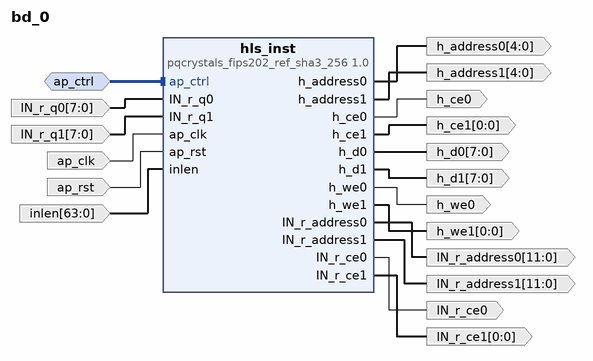
[diagram p0: block diagram of the top level]
# Vivado block design bd_0, xc7a75tlftg256-2L, Vivado 2018.3
create_bd_design bd_0

create_bd_intf_port -mode Slave -vlnv xilinx.com:interface:acc_handshake_rtl:1.0 ap_ctrl
create_bd_port -dir O -from 11 -to 0 -type data IN_r_address0
create_bd_port -dir O -from 11 -to 0 -type data IN_r_address1
create_bd_port -dir O IN_r_ce0
create_bd_port -dir O -from 0 -to 0 -type data IN_r_ce1
create_bd_port -dir I -from 7 -to 0 -type data IN_r_q0
set_property -dict [list \
  CONFIG.LAYERED_METADATA {xilinx.com:interface:datatypes:1.0 {DATA {datatype {name {attribs {resolve_type immediate dependency {} format string minimum {} maximum {}} value {}} bitwidth {attribs {resolve_type immediate dependency {} format long minimum {} maximum {}} value 8} bitoffset {attribs {resolve_type immediate dependency {} format long minimum {} maximum {}} value 0} integer {signed {attribs {resolve_type immediate dependency {} format bool minimum {} maximum {}} value false}}}}}} \
] [get_bd_ports IN_r_q0]
create_bd_port -dir I -from 7 -to 0 -type data IN_r_q1
set_property -dict [list \
  CONFIG.LAYERED_METADATA {xilinx.com:interface:datatypes:1.0 {DATA {datatype {name {attribs {resolve_type immediate dependency {} format string minimum {} maximum {}} value {}} bitwidth {attribs {resolve_type immediate dependency {} format long minimum {} maximum {}} value 8} bitoffset {attribs {resolve_type immediate dependency {} format long minimum {} maximum {}} value 0}}}}} \
] [get_bd_ports IN_r_q1]
create_bd_port -dir I -type clk ap_clk
set_property -dict {CONFIG.FREQ_HZ 100000000.0} [get_bd_ports ap_clk]
create_bd_port -dir I -type rst ap_rst
set_property -dict {CONFIG.POLARITY ACTIVE_HIGH} [get_bd_ports ap_rst]
create_bd_port -dir O -from 4 -to 0 -type data h_address0
create_bd_port -dir O -from 4 -to 0 -type data h_address1
create_bd_port -dir O h_ce0
create_bd_port -dir O -from 0 -to 0 -type data h_ce1
create_bd_port -dir O -from 7 -to 0 -type data h_d0
create_bd_port -dir O -from 7 -to 0 -type data h_d1
create_bd_port -dir O h_we0
create_bd_port -dir O -from 0 -to 0 -type data h_we1
create_bd_port -dir I -from 63 -to 0 -type data inlen
set_property -dict [list \
  CONFIG.LAYERED_METADATA {xilinx.com:interface:datatypes:1.0 {DATA {datatype {name {attribs {resolve_type immediate dependency {} format string minimum {} maximum {}} value {}} bitwidth {attribs {resolve_type immediate dependency {} format long minimum {} maximum {}} value 64} bitoffset {attribs {resolve_type immediate dependency {} format long minimum {} maximum {}} value 0} integer {signed {attribs {resolve_type immediate dependency {} format bool minimum {} maximum {}} value true}}}}}} \
] [get_bd_ports inlen]

create_bd_cell -type ip -vlnv xilinx.com:hls:pqcrystals_fips202_ref_sha3_256:1.0 hls_inst

# ---- connections ----

connect_bd_intf_net -intf_net ap_ctrl_0_1 [get_bd_intf_ports ap_ctrl] [get_bd_intf_pins hls_inst/ap_ctrl]
connect_bd_net [get_bd_pins hls_inst/IN_r_address0] [get_bd_ports IN_r_address0]
connect_bd_net [get_bd_pins hls_inst/IN_r_address1] [get_bd_ports IN_r_address1]
connect_bd_net [get_bd_pins hls_inst/IN_r_ce0] [get_bd_ports IN_r_ce0]
connect_bd_net [get_bd_pins hls_inst/IN_r_ce1] [get_bd_ports IN_r_ce1]
connect_bd_net -net IN_r_q0_0_1 [get_bd_ports IN_r_q0] [get_bd_pins hls_inst/IN_r_q0]
connect_bd_net -net IN_r_q1_0_1 [get_bd_ports IN_r_q1] [get_bd_pins hls_inst/IN_r_q1]
connect_bd_net -net ap_clk_0_1 [get_bd_ports ap_clk] [get_bd_pins hls_inst/ap_clk]
connect_bd_net -net ap_rst_0_1 [get_bd_ports ap_rst] [get_bd_pins hls_inst/ap_rst]
connect_bd_net [get_bd_pins hls_inst/h_address0] [get_bd_ports h_address0]
connect_bd_net [get_bd_pins hls_inst/h_address1] [get_bd_ports h_address1]
connect_bd_net [get_bd_pins hls_inst/h_ce0] [get_bd_ports h_ce0]
connect_bd_net [get_bd_pins hls_inst/h_ce1] [get_bd_ports h_ce1]
connect_bd_net [get_bd_pins hls_inst/h_d0] [get_bd_ports h_d0]
connect_bd_net [get_bd_pins hls_inst/h_d1] [get_bd_ports h_d1]
connect_bd_net [get_bd_pins hls_inst/h_we0] [get_bd_ports h_we0]
connect_bd_net [get_bd_pins hls_inst/h_we1] [get_bd_ports h_we1]
connect_bd_net -net inlen_0_1 [get_bd_ports inlen] [get_bd_pins hls_inst/inlen]

validate_bd_design
save_bd_design
